# Altium schematic sheet Power_3v3.SchDoc
size C
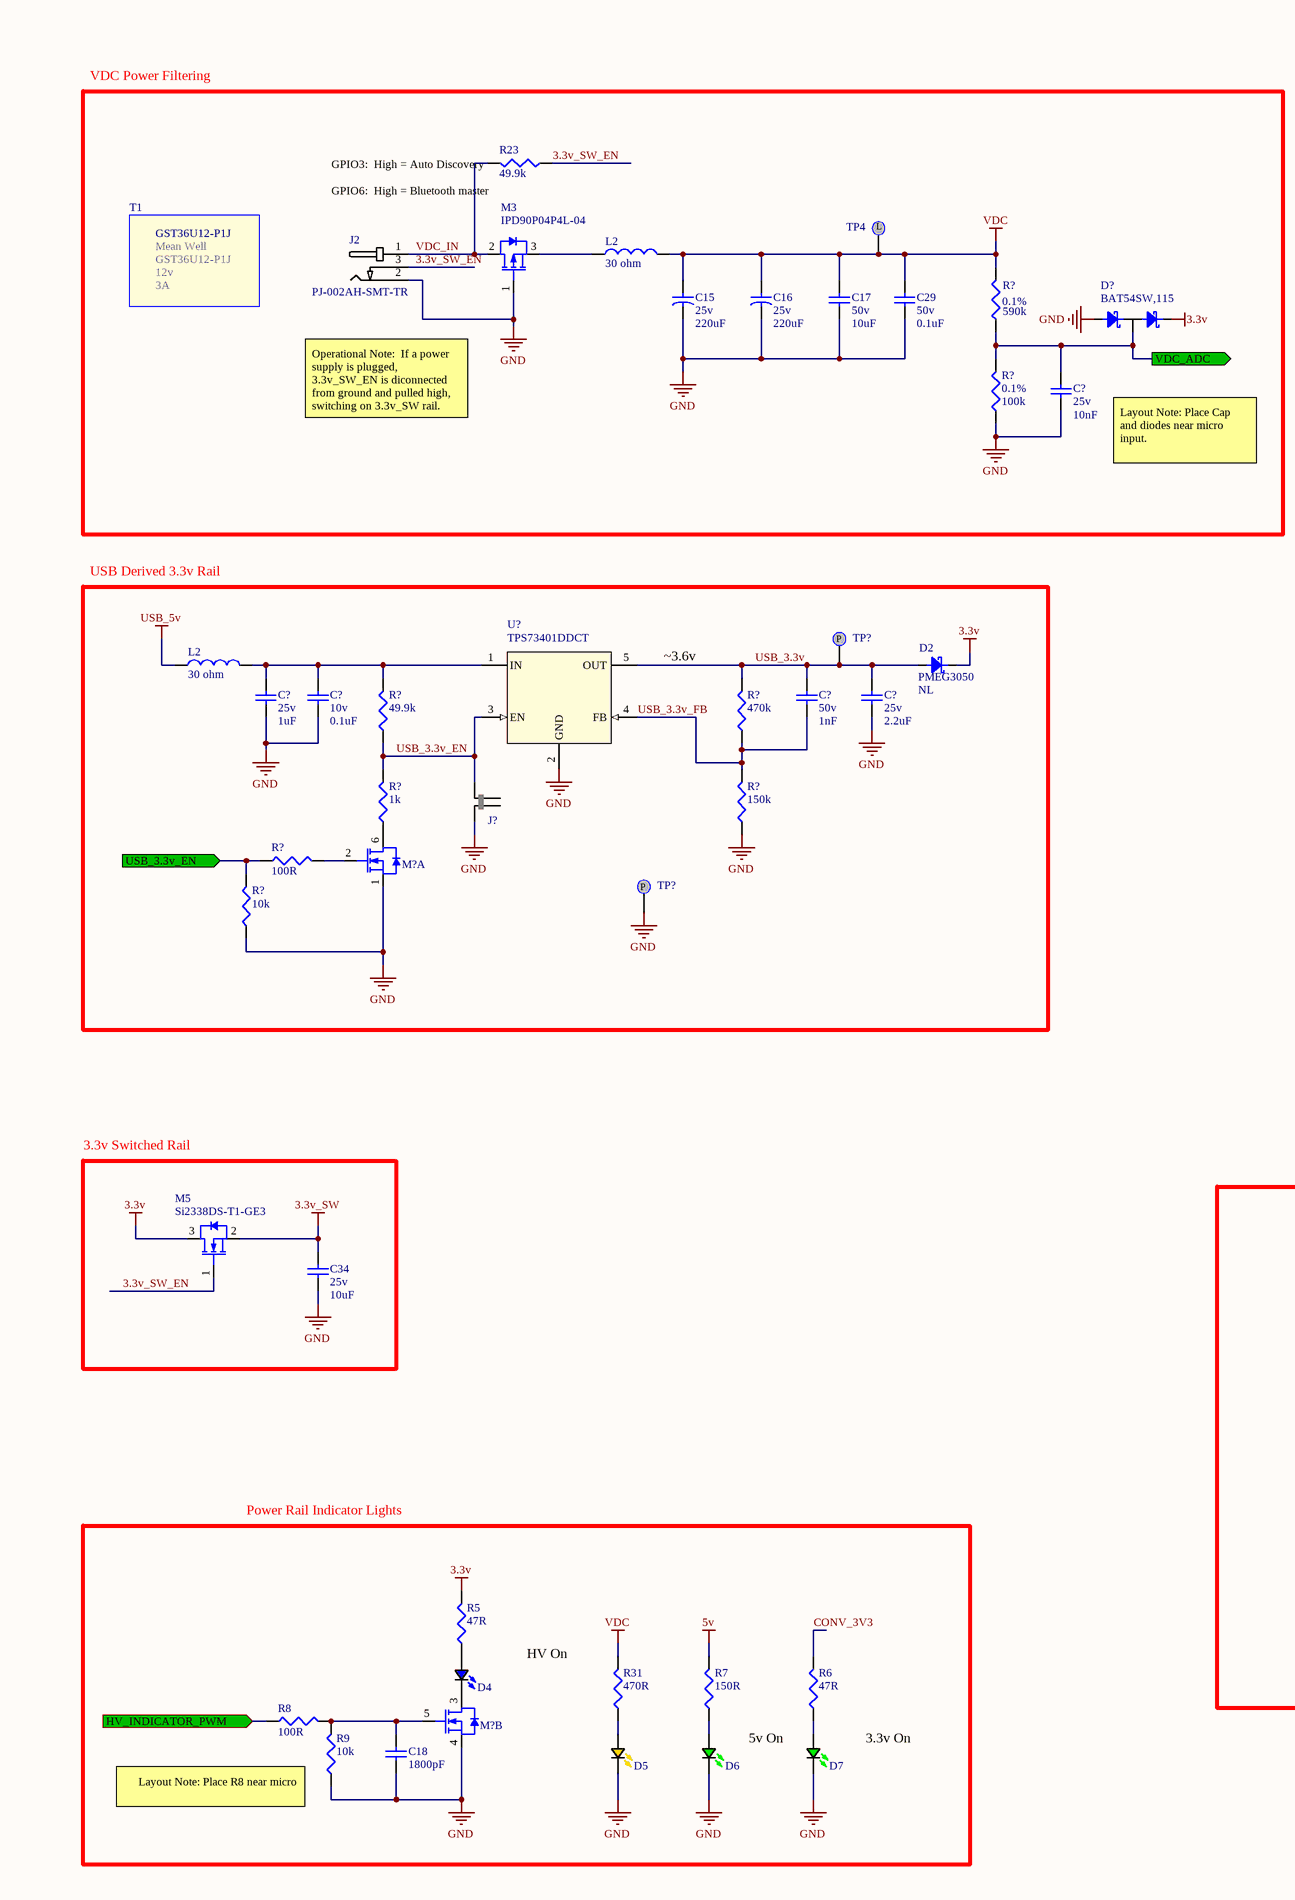
[diagram p0: Power_3v3.SchDoc, left]
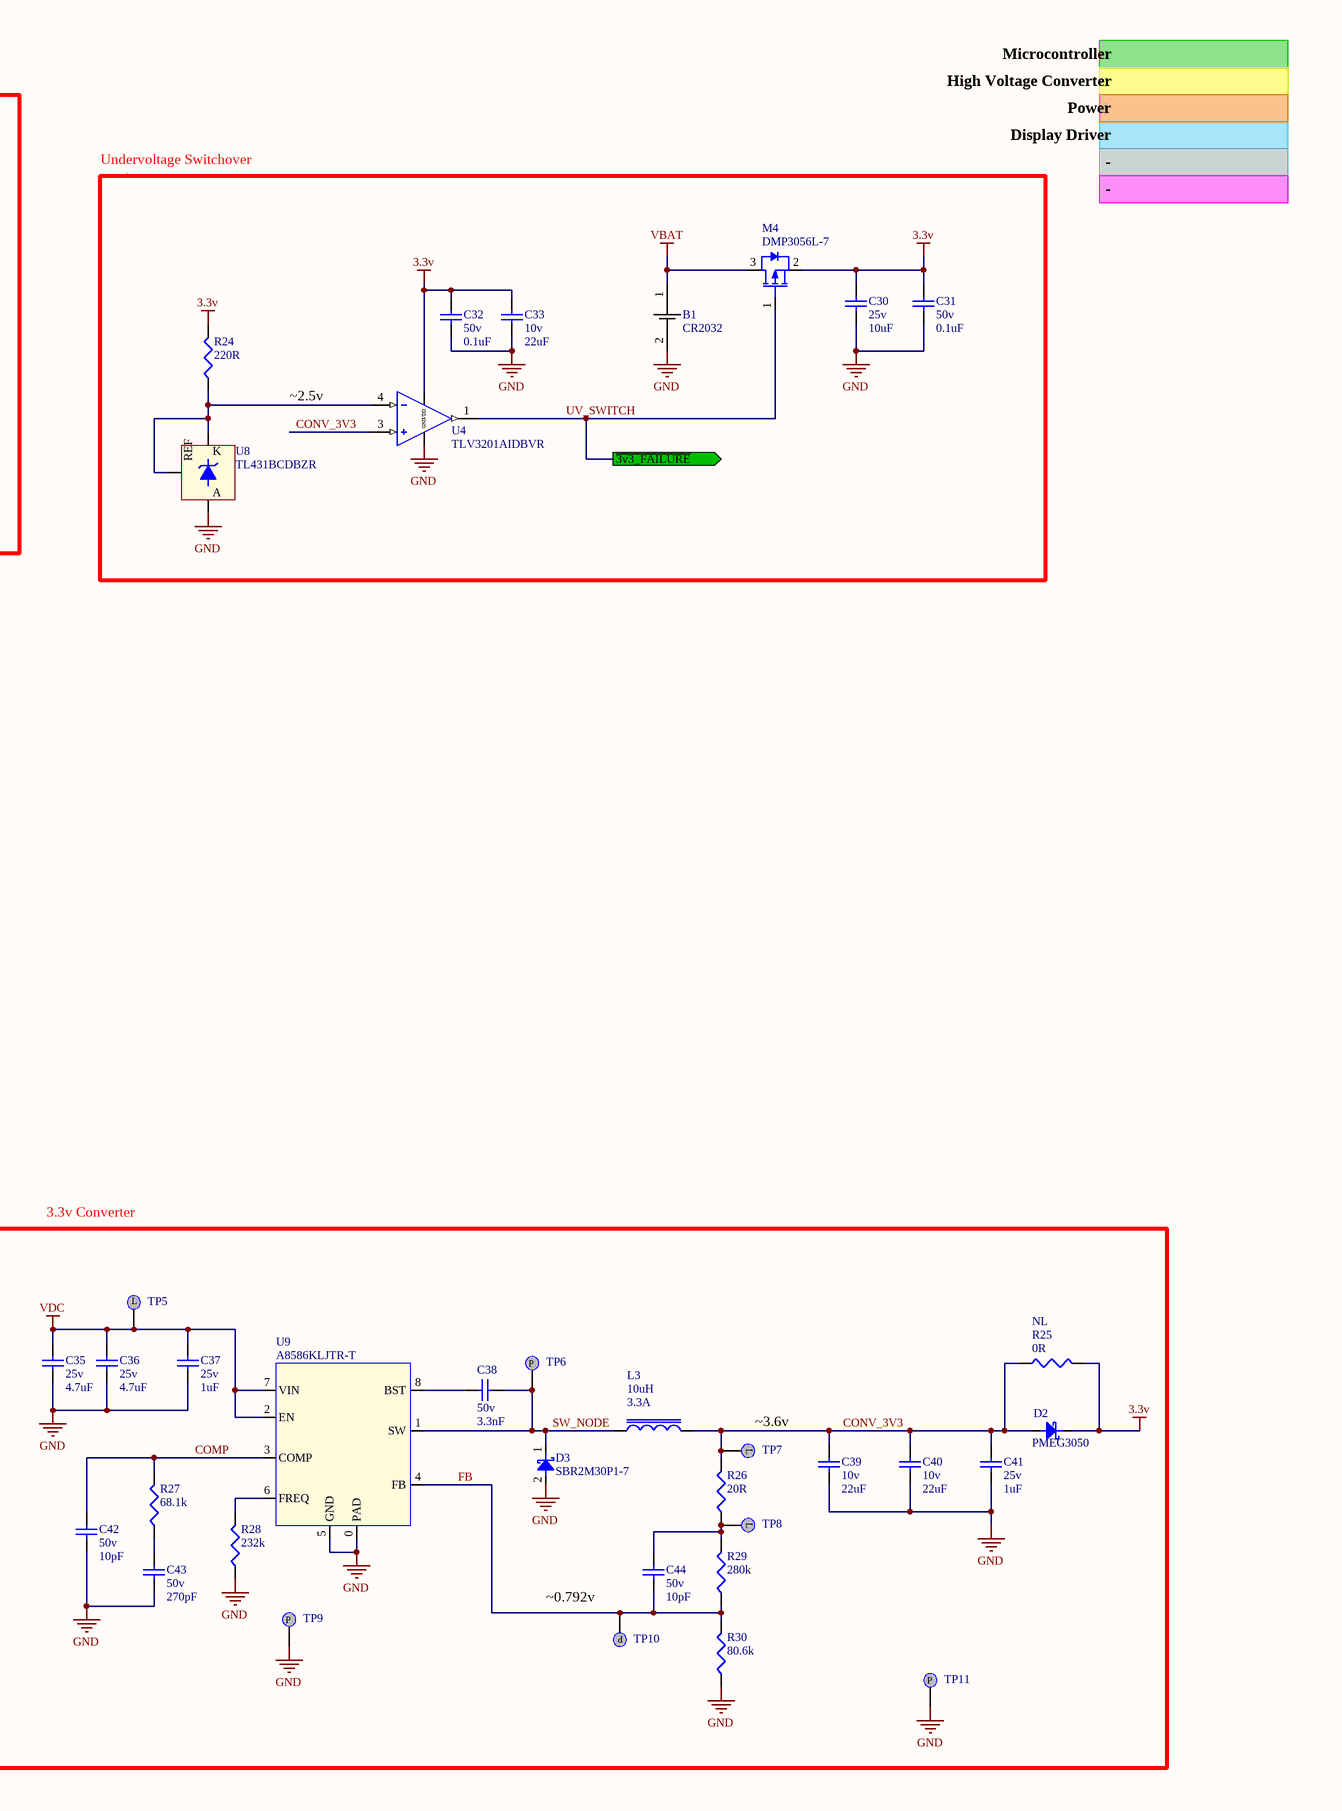
[diagram p1: Power_3v3.SchDoc, right]

## Parts
(Parts that share a designator on the sheet are numbered #1, #2 ... from top to bottom, then left to right.)
B1  CR2032  [2032 Holder]
C15  Voltage: 25v  [SMD ELEC CAP (D=6.3, L=7.7, H=8)]  (hidden comment: 220uF)
C16  Voltage: 25v  [SMD ELEC CAP (D=6.3, L=7.7, H=8)]  (hidden comment: 220uF)
C17  Voltage: 50v  [CAP1206R]  (hidden comment: 10uF)
C18  1800pF  [CAP0603R]
C29  Voltage: 50v  [CAP0603R]  (hidden comment: 0.1uF)
C30  Voltage: 25v  [CAP1206R]  (hidden comment: 10uF)
C31  Voltage: 50v  [CAP0603R]  (hidden comment: 0.1uF)
C32  Voltage: 50v  [CAP0603R]  (hidden comment: 0.1uF)
C33  Voltage: 10v  [CAP1210R]  (hidden comment: 22uF)
C34  Voltage: 25v  [CAP1206R]  (hidden comment: 10uF)
C35  Voltage: 25v  [CAP1206R]  (hidden comment: 4.7uF)
C36  Voltage: 25v  [CAP1206R]  (hidden comment: 4.7uF)
C37  Voltage: 25v  [CAP0603R]  (hidden comment: 1uF)
C38  Voltage: 50v  [CAP0603R]  (hidden comment: 3.3nF)
C39  Voltage: 10v  [CAP1210R]  (hidden comment: 22uF)
C40  Voltage: 10v  [CAP1210R]  (hidden comment: 22uF)
C41  Voltage: 25v  [CAP0603R]  (hidden comment: 1uF)
C42  Voltage: 50v  [CAP0402R]  (hidden comment: 10pF)
C43  Voltage: 50v  [CAP0603R]  (hidden comment: 270pF)
C44  Voltage: 50v  [CAP0402R]  (hidden comment: 10pF)
C?#1  Voltage: 25v  [CAP0402R]  (hidden comment: 10nF)
C?#2  Voltage: 25v  [CAP0603R]  (hidden comment: 1uF)
C?#3  Voltage: 10v  [CAP0402R]  (hidden comment: 0.1uF)
C?#4  Voltage: 50v  [CAP0402R]  (hidden comment: 1nF)
C?#5  Voltage: 25v  [CAP1206R]  (hidden comment: 2.2uF)
D2#1  PMEG3050  LOAD: NL  [SOD128]
D2#2  PMEG3050  [SOD128]
D3  SBR2M30P1-7  [PowerDI123]
D4  LTST-C193TBKT-5A  (value not drawn)
D5  LTST-C190AKT  [LED Amber 0603]  (value not drawn)
D6  LTST-S270KGKT  [LED Green 0603]  (value not drawn)
D7  LTST-S270KGKT  [LED Green 0603]  (value not drawn)
D?  BAT54SW,115  [SOT-323]
J2  PJ-002AH-SMT-TR  [PJ-002AH-SMT-TR]
J?  None  [Jumper_2.54mm_2x1]  (value not drawn)
L2#1  30 ohm  [RES0805R]
L2#2  30 ohm  [RES0805R]
L3  10uH  CURRENT: 3.3A
M3  IPD90P04P4L-04  [DPAK2]
M4  DMP3056L-7  [SOT23-3M]
M5  Si2338DS-T1-GE3  [SOT23-3M]
M?#1  NX3020NAKV,115  [SOT666-6N]  (value not drawn)  (part A of 2)
M?#2  NX3020NAKV,115  [SOT666-6N]  (value not drawn)  (part B of 2)
R5  47R  [RES0603R]
R6  47R  [RES0603R]
R7  150R  [RES0603R]
R8  100R  [RES0603R]
R9  10k  [RES0603R]
R23  49.9k  [RES0402R]
R24  220R  [RES0402R]
R25  Load: NL  [RES1206R]  (hidden comment: 0R)
R26  20R  [RES0402R]
R27  68.1k  [RES0402R]
R28  232k  [RES0402R]
R29  280k  [RES0402R]
R30  80.6k  [RES0402R]
R31  470R  [RES0603R]
R?#1  Tolerance: 0.1%  [RES0805R]  (hidden comment: 590k)
R?#2  Tolerance: 0.1%  [RES0603R]  (hidden comment: 100k)
R?#3  49.9k  [RES0402R]
R?#4  470k  [RES0402R]
R?#5  1k  [RES0402R]
R?#6  150k  [RES0402R]
R?#7  100R  [RES0402R]
R?#8  10k  [RES0402R]
T1  GST36U12-P1J  MFG: Mean Well  VOUT: 12v  CURRENT: 3A
TP4  5001  [5001 Testpoint]  (value not drawn)
TP5  5001  [5001 Testpoint]  (value not drawn)
TP6  NONE  [TESTPOINT - 1.5mm Round Pad]  (value not drawn)
TP7  5001  [5001 Testpoint]  (value not drawn)
TP8  5001  [5001 Testpoint]  (value not drawn)
TP9  NONE  [TESTPOINT - 1.5mm Round Pad]  (value not drawn)
TP10  NONE  [TESTPOINT - 1.5mm Round Pad]  (value not drawn)
TP11  NONE  [TESTPOINT - 1.5mm Round Pad]  (value not drawn)
TP?#1  NONE  [TESTPOINT - 1.5mm Round Pad]  (value not drawn)
TP?#2  NONE  [TESTPOINT - 1.5mm Round Pad]  (value not drawn)
U4  TLV3201AIDBVR  [SOT23-5]
U8  TL431BCDBZR  [SOT23-3M]
U9  A8586KLJTR-T  [HSOIC-8]
U?  TPS73401DDCT  [SOT23-5]

## Blocks framed on the sheet
VDC Power Filtering: C15-C17 C29 C?#1 D? J2 L2#1 M3 R23 R?#1 R?#2 T1 TP4
3.3v Switched Rail: C34 M5

## Ports
HV_INDICATOR_PWM (in), USB_3.3v_EN (in), VDC_ADC (out), ~{3v3_FAILURE} (out)

## Nets
3.3v: C30.1 C31.1 C32.1 C33.1 D2#1.1(K) D2#2.1(K) D?.2(A) M4.2(DRAIN) M5.3(DRAIN) R5.2 R24.2 R25.2 U4.5(VDD)
3.3v_SW: C34.1 M5.2(SOURCE)
5v: R7.2
GND: B1.2 C15.1 C16.1 C17.2 C18.2 C29.2 C30.2 C31.2 C32.2 C33.2 C34.2 C35.2 C36.2 C37.2 C39.2 C40.2 C41.2 C42.2 C43.2 C?#1.2 C?#2.2 C?#3.2 C?#5.2 D3.2(A) D5.1(K) D6.1(K) D7.1(K) D?.1(A) J2.2(RING) J?.1 M3.1(GATE) M?#1.1(S1) M?#2.4(S2) R9.1 R28.1 R30.1 R?#2.1 R?#6.1 R?#8.1 TP9.1 TP11.1 TP?#2.1 U4.2(GND) U8.3(A) U9.0(PAD) U9.5(GND) U?.2(GND)
USB_5v: L2#2.1
VBAT: B1.1 M4.3(SOURCE)
VDC: C15.2 C16.2 C17.1 C29.1 C35.1 C36.1 C37.1 L2#1.2 R31.2 R?#1.2 TP4.1 TP5.1 U9.2(EN) U9.7(VIN)
3.3v_SW_EN: J2.3(SWITCH) M5.1(GATE) R23.1
COMP: C42.1 R27.2 U9.3(COMP)
CONV_3V3: C39.1 C40.1 C41.1 D2#2.2(A) L3.2 R6.2 R25.1 R26.2 TP7.1 U4.3(+)
FB: C44.2 R29.1 R30.2 TP10.1 U9.4(FB)
HV_INDICATOR_PWM: R8.1 ; port HV_INDICATOR_PWM
SW_NODE: C38.2 D3.1(K) L3.1 TP6.1 U9.1(SW)
USB_3.3v: C?#4.1 C?#5.1 D2#1.2(A) R?#4.2 TP?#1.1 U?.5(OUT)
USB_3.3v_EN: J?.2 R?#3.1 R?#5.2 U?.3(EN)
USB_3.3v_EN: R?#7.1 R?#8.2 ; port USB_3.3v_EN  [a separate net that carries the same name]
USB_3.3v_FB: C?#4.2 R?#4.1 R?#6.2 U?.4(FB)
UV_SWITCH: M4.1(GATE) U4.1(OUT) ; port ~{3v3_FAILURE}
VDC_ADC: C?#1.1 D?.3(AK) R?#1.1 R?#2.2 ; port VDC_ADC
VDC_IN: J2.1(PIN) M3.2(DRAIN) R23.2
NetC18_1: C18.1 M?#2.5(G2) R8.2 R9.2
NetC38_1: C38.1 U9.8(BST)
NetC43_1: C43.1 R27.1
NetC44_1: C44.1 R26.1 R29.2 TP8.1
NetC?#2_1: C?#2.1 C?#3.1 L2#2.2 R?#3.2 U?.1(IN)
NetD4_1: D4.1(K) M?#2.3(D2)
NetD4_2: D4.2(A) R5.1
NetD5_2: D5.2(A) R31.1
NetD6_2: D6.2(A) R7.1
NetD7_2: D7.2(A) R6.1
NetL2#1_1: L2#1.1 M3.3(SOURCE)
NetM?#1_2: M?#1.2(G1) R?#7.2
NetM?#1_6: M?#1.6(D1) R?#5.1
NetR24_1: R24.1 U4.4(-) U8.1(K) U8.2(REF)
NetR28_2: R28.2 U9.6(FREQ)

## Notes on the sheet
- Microcontroller
- High Voltage Converter
- Display Driver
- Power
- Undervoltage Switchover
- -
- ~2.5v
- Operational Note:  If a power supply is plugged, 3.3v_SW_EN is diconnected from ground and pulled high, switching on 3.3v_SW rail.
- Layout Note: Place Cap and diodes near micro input.
- USB Derived 3.3v Rail
- ~3.6v
- 3.3v Converter
- (near TP7) ~3.6v
- Power Rail Indicator Lights
- (near TP10) ~0.792v
- HV On
- (near D6) 5v On
- (near D7) 3.3v On
- (near R9) Layout Note: Place R8 near micro
- (in symbol GST36U12-P1J) GPIO3:  High = Auto Discovery / GPIO6:  High = Bluetooth master / GPIO7:  Low = 115200bps, High = 9600bps /
- (in symbol Testpoint 1.5mm Pad) P
- (in symbol Testpoint Loop) L

## Library data of the parts
B1 = 2032 Coin Cell Holder: SMD Coin Cell Holder for CR2032; MFG_PN: SMTU2032-LF.TR; MFG: RENATA; CELL_TYPE: CR2032
C15 C16 = 220uF / 25v: Tolerance: 20%; MFG_PN: EEE-FTE221XAP; MFG: PANASONIC; ESR: 160mohm; LOAD: NL; Value: 220uF
C17 = 10uF 50v (1206): Tolerance: 10%; MFG_PN: C3216X5R1H106K160AB; MFG: TDK; LOAD: NL; Value: 10uF
C18 = 1800pF: Tolerance: 5%; MFG1_PN: VJ0603Y182JXAAC; MFG1: Vishay; Voltage: 50v; Value: 1800pF
C29 C31 C32 = 0.1uF 50v (0603): MFG_PN: VJ0603V104ZXAPW1BC; MFG: Vishay; LOAD: NL; Value: 0.1uF
C30 C34 = 10uF 25v (1206): Tolerance: 10%; MFG_PN: GRJ31CR71E106KE11L; MFG: MURATA; LOAD: NL; Value: 10uF
C33 C39 C40 = 22uF 10v (1210): Tolerance: 10%; MFG_PN: GCM32ER71A226ME12L; MFG: MURATA; LOAD: NL; Value: 22uF
C35 C36 = 4.7uF 25v (1206): Tolerance: 10%; MFG_PN: GCM31CR71E475KA55L; MFG: Murata; LOAD: NL; Value: 4.7uF
C37 C41 C?#2 = 1uF 25v (0603): MFG_PN: VJ0805V105ZXXTW1BC; MFG: Vishay; LOAD: NL; Value: 1uF
C38 = 47nF 50v (0603): Tolerance: 10%; MFG_PN: VJ0603Y473KXACW1BC; MFG: VISHAY; Value: 3.3nF
C42 C44 = 10pF 50v (0402): Tolerance: 10%; MFG_PN: VJ0402Y100KXACW1BC; MFG: Vishay; LOAD: NL; Value: 10pF
C43 = 270pF 50v (0603): Tolerance: 5%; MFG_PN: VJ0603A271JXACW1BC; MFG: Vishay; LOAD: NL; Value: 270pF
C?#1 = 10nF 25v (0402): Tolerance: 5%; MFG_PN: VJ0402Y103JXXAC; MFG: Vishay; LOAD: NL; Value: 10nF
C?#3 = 0.1uF 10v (0402): Tolerance: 20%; MFG_PN: VJ0402G104MXQCW1BC; MFG: Vishay; LOAD: NL; Value: 0.1uF
C?#4 = 1nF 50v (0402): Tolerance: 10%; MFG_PN: VJ0402Y102KXAAC; MFG: Vishay; LOAD: NL; Value: 1nF
C?#5 = 2.2uF 25v (1206): MFG1_PN: VJ1206V225ZXXRW1BC; MFG1: Vishay; Value: 2.2uF
D2#1 = PMEG3050EP: MFG: NXP; CURRENT: 5A; VF: 0.35v; MFG_PN: PMEG3050EP,115
D2#2 = PMEG3050EP: MFG: NXP; CURRENT: 5A; VF: 0.35v; MFG_PN: PMEG3050EP,115; LOAD: NL
D3 = SBR2M30P1-7: Schottky Diode - 2A; MFG: DIODES INC; VF: 390mV; LOAD: NL; Value: *; CURRENT: 2A; MFG_PN: SBR2M30P1-7
D4 = LED Blue 0603: MFG: Lite On; VFORWARD: 2.8v; CURRENT: 20mA; COLOR: Blue; MFG_PN: LTST-C193TBKT-5A
D5 = LED Amber 0603: MFG: Lite On; VFORWARD: 2.1v; CURRENT: 20mA; COLOR: Amber; MFG_PN: LTST-C190AKT
D6 D7 = LED Green 0603: MFG: Lite On; VFORWARD: 2v; CURRENT: 20mA; COLOR: Green; MFG_PN: LTST-S270KGKT
D? = BAT54S: Series connected dual Schottky diode; MFG: NXP; CONFIG: SERIES DUAL; REV_VOLTAGE: 30v; MFG_PN: BAT54SW,115
J2 = PJ-002AH-SMT-TR: 2.0mm ID/6.5mm OD Barrel Plug; MFG: CUI; VOLTAGE: 16v; CURRENT: 5A; MFG_PN: PJ-002AH-SMT-TR
J? = Jumper x1: Jumper_Single_2.54mm
L2#1 L2#2 = EMI Ferrite (0805): MFG: MURATA; MFG_PN: BLM21PG300SN1D; CURRENT: 3A; LOAD: NL; TOLERANCE: 20%; IMPEDANCE: 30 ohm
L3 = 10uH 3.3A: Inductor, 10uH, 3.3A; MFG: LAIRD; MFG_PN: TYS8040100M-10; RES: 29mOhm; ISAT: 3.6A; VALUE: 10uH
M3 = IPD90P04P4L-04: PFET_SINGLE_90A_40v; LOAD: NL; MFG: INFINEON; VDS_MAX: -40v; I_MAX: 90A; VGS_MAX: 16v; P_MAX: 125W; RDS_ON: 4.3m; VGS_TH: -2.2v; Q_GATE: 176nC; MFG_PN: IPD90P04P4L-04
M4 = DMP3056L: PFET_SINGLE_4.3A_30v; LOAD: NL; MFG: DIODES_INC; VDS_MAX: -30v; I_MAX: -4.3A; VGS_MAX: 25v; P_MAX: 1.38W; RDS_ON: 35m; VGS_TH: -1v; MFG_PN: DMP3056L-7
M5 = Si2338DS: NFET_SINGLE_6A_30V; LOAD: NL; MFG: VISHAY; VDS_MAX: 30v; I_MAX: 6A; VGS_MAX: 20v; RDS_ON: 23m; Q_GATE: 8.2nC; P_MAX: *; MFG_PN: Si2338DS-T1-GE3
M?#1 M?#2 = NX3020NAKV: NFET_DUAL_200mA_30v; LOAD: NL; MFG: NXP; VDS_MAX: 30v; I_MAX: 200mA; P_MAX: 1.1W; RDS_ON: 2.7; VGS_MAX: *; MFG_PN: NX3020NAKV,115
R5 R6 = 47R: Tolerance: 1%; POWER: 0.1W; MFG1_PN: CRCW060347R0FKEA; MFG1: Vishay; Load: NL; Value: 47R
R7 = 150R: Tolerance: 1%; POWER: 0.1W; MFG1_PN: CRCW0603150RFKEA; MFG1: Vishay; Load: NL; Value: 150R
R8 = 100R: Tolerance: 1%; POWER: 0.1W; MFG1_PN: CRCW0603100RFKEA; MFG1: Vishay; Load: NL; Value: 100R
R9 = 10K: Tolerance: 1%; POWER: 0.1W; MFG1_PN: CRCW060310K0FKEA; MFG1: Vishay; Load: NL; Value: 10k
R23 R?#3 = 49.9k (0402): Tolerance: 1%; POWER: 63mW; MFG_PN: CRCW040249K9FKED; MFG: Vishay; Load: NL; Value: 49.9k
R24 = 220R (0402): Tolerance: 1%; POWER: 63mW; MFG_PN: CRCW0402220RFKED; MFG: Vishay; Load: NL; Value: 220R
R25 = 0R (1206): 0R, 1206; MFG_PN: CRCW12060000Z0EA; MFG: Vishay; Value: 0R
R26 = 20R (0402): Tolerance: 1%; POWER: 63mW; MFG_PN: CRCW040220R0FKED; MFG: Vishay; Load: NL; Value: 20R
R27 = 68.1k (0402): Tolerance: 1%; POWER: 63mW; MFG_PN: CRCW0402232KFKED; MFG: Vishay; Load: NL; Value: 68.1k
R28 = 232k (0402): Tolerance: 1%; POWER: 63mW; MFG_PN: CRCW0402232KFKED; MFG: Vishay; Load: NL; Value: 232k
R29 = 280k (0402): Tolerance: 1%; POWER: 63mW; MFG_PN: CRCW0402280KFKED; MFG: Vishay; Load: NL; Value: 280k
R30 = 80.6k (0402): Tolerance: 1%; POWER: 63mW; MFG_PN: CRCW040280K6FKED; MFG: Vishay; Load: NL; Value: 80.6k
R31 = 470R (0603): Tolerance: 1%; POWER: 0.1W; MFG_PN: CRCW0603470RFKEA; MFG: Vishay; Load: NL; Value: 470R
R?#1 = 590k   0.1% (0805): POWER: 0.125W; MFG_PN: TNPW0805590KBEEA; MFG: Vishay; Load: NL; Value: 590k
R?#2 = 100k  0.1% (0603): POWER: 0.1W; MFG_PN: TNPW0603100KBEEA; MFG: Vishay; Load: NL; Value: 100k
R?#4 = 470k (0402): Tolerance: 1%; POWER: 63mW; MFG_PN: CRCW0402470KFKED; MFG: Vishay; Load: NL; Value: 470k
R?#5 = 1k (0402): Tolerance: 1%; POWER: 63mW; MFG_PN: CRCW04021K00FKED; MFG: Vishay; Load: NL; Value: 1k
R?#6 = 150k (0402): Tolerance: 1%; POWER: 63mW; MFG_PN: CRCW0402150KFKED; MFG: Vishay; Load: NL; Value: 150k
R?#7 = 100R (0402): Tolerance: 1%; POWER: 63mW; MFG_PN: CRCW0402100RFKED; MFG: Vishay; Load: NL; Value: 100R
R?#8 = 10k (0402): Tolerance: 1%; POWER: 63mW; MFG_PN: CRCW040210K0FKED; MFG: Vishay; Load: NL; Value: 10k
T1 = GST36U12-P1J: 12v/3A Wall Mount AC Adapter; PLUG_TYPE: 2.1mm Barrel Plug; MFG_PN: GST36U12-P1J
TP4 TP5 TP7 TP8 = Testpoint Loop: MFG: KEYSTONE; MFG_PN: 5001
TP6 TP9-TP11 TP?#1 TP?#2 = Testpoint 1.5mm Pad: 1.5mm Testpoint
U4 = TLV3201AIDBVR: High Speed Analog Comparator; LOAD: NL; MFG: TI; OUTPUT_TYPE: PUSH-PULL; RESPONSE_TIME: 47ns; MFG_PN: TLV3201AIDBVR
U8 = TL431: Voltage Reference; MFG: TI; MFG_PN: TL431BCDBZR
U9 = A8586: Buck Converter, 3.5A, Adj; MFG: ALLEGRO; MFG_PN: A8586KLJTR-T; CURRENT: 3.5A; VOUT: ADJ
U? = TPS73401DDCT: TPS73401DDCT, LDO, 250mA, Adj; MFG: TI; MFG_PN: TPS73401DDCT; CURRENT: 250mA; VOUT: Adj